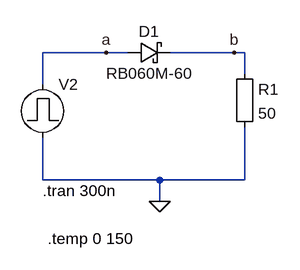
[diagram p0: schematic TRR-10.asc]
TRR-10.asc, the LTspice schematic file:
Version 4
SHEET 1 880 680
WIRE -112 80 -208 80
WIRE -80 80 -112 80
WIRE 80 80 -16 80
WIRE 96 80 80 80
WIRE 96 112 96 80
WIRE -208 128 -208 80
WIRE -208 272 -208 208
WIRE -32 272 -208 272
WIRE 96 272 96 192
WIRE 96 272 -32 272
WIRE -32 304 -32 272
FLAG -32 304 0
FLAG 80 80 b
FLAG -112 80 a
SYMBOL schottky -80 96 R270
WINDOW 0 32 32 VTop 2
WINDOW 3 0 32 VBottom 2
SYMATTR InstName D1
SYMATTR Value RB060M-60
SYMATTR Description Diode
SYMATTR Type diode
SYMBOL Misc\\EuropeanResistor 80 96 R0
SYMATTR InstName R1
SYMATTR Value 50
SYMBOL pulse -208 112 R0
WINDOW 3 15 105 Invisible 2
WINDOW 123 0 0 Left 0
WINDOW 39 0 0 Left 0
SYMATTR InstName V2
SYMATTR Value PULSE(+6V -6V 100n 10n 10n 100n 300n)
TEXT -208 288 Left 2 !.tran 300n
TEXT -200 360 Left 2 !.temp 0 150

The netlist it stands for:
* TRR-10.asc
D1 a b RB060M-60
R1 b 0 50
V2 a 0 PULSE(+6V -6V 100n 10n 10n 100n 300n)
.model D D
.lib standard.dio
.tran 300n
.temp 0 150
.backanno
.end